# EAGLE design STM32G030F6P6TR-dev-board-plus-imu (EAGLE 9.4.2)
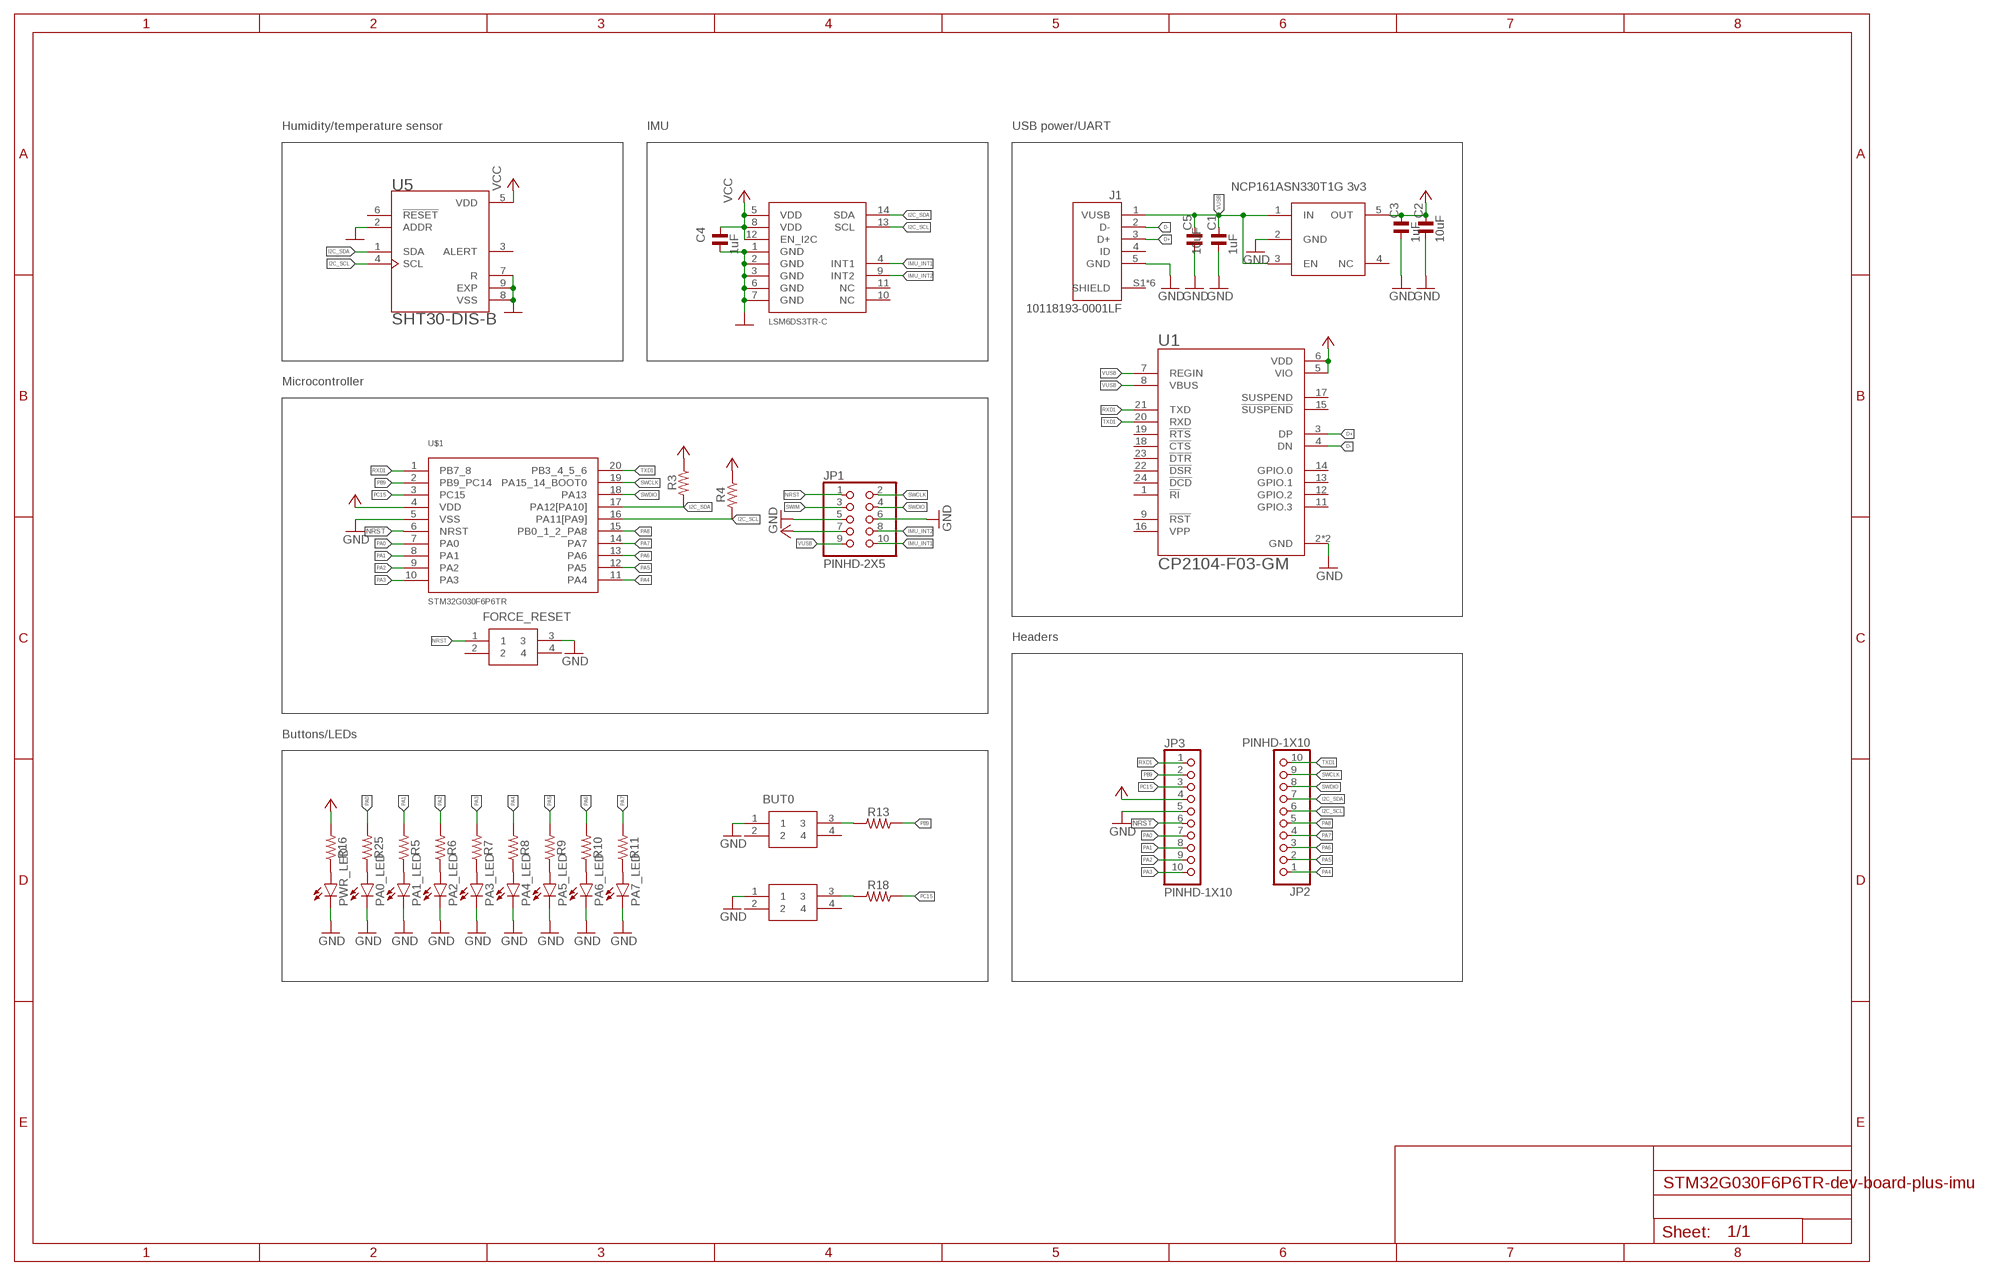
[diagram p0: schematic, sheet 1]

## Parts
3V3_REG1  3V3  NCP718BSN330T1G  [NCP718BSN330T1G]
BUT0  PTS645SM43SMTR92LFS  [PTS645(SMT)]
BUT1  PTS645SM43SMTR92LFS  [PTS645(SMT)]
C1  1uF  RC-MASTER-SMD_C_0603MP  [RC-MASTER-SMD_C0603MP]
C2  10uF  RC-MASTER-SMD_C_0603MP  [RC-MASTER-SMD_C0603MP]
C3  1uF  RC-MASTER-SMD_C_0603MP  [RC-MASTER-SMD_C0603MP]
C4  1uF  RC-MASTER-SMD_C_0603MP  [RC-MASTER-SMD_C0603MP]
C5  10uF  RC-MASTER-SMD_C_0603MP  [RC-MASTER-SMD_C0603MP]
FORCE_RESET  PTS645SM43SMTR92LFS  [PTS645(SMT)]
J1  10118193-0001LF  [FCI_10118193-0001LF]
JP1  PINHD-2X5  [2X05]
JP2  PINHD-1X10  [1X10]
JP3  PINHD-1X10  [1X10]
PA0_LED  20mA  LEDCHIP-LED0603  [CHIP-LED0603]
PA1_LED  20mA  LEDCHIP-LED0603  [CHIP-LED0603]
PA2_LED  20mA  LEDCHIP-LED0603  [CHIP-LED0603]
PA3_LED  20mA  LEDCHIP-LED0603  [CHIP-LED0603]
PA4_LED  20mA  LEDCHIP-LED0603  [CHIP-LED0603]
PA5_LED  20mA  LEDCHIP-LED0603  [CHIP-LED0603]
PA6_LED  20mA  LEDCHIP-LED0603  [CHIP-LED0603]
PA7_LED  20mA  LEDCHIP-LED0603  [CHIP-LED0603]
PWR_LED  20mA  LEDCHIP-LED0603  [CHIP-LED0603]
R3  3k3  52101-101-REV-A_RC-MASTER-SMD_R_0603MP  [52101-101-REV-A_RC-MASTER-SMD_R0603MP]
R4  3k3  52101-101-REV-A_RC-MASTER-SMD_R_0603MP  [52101-101-REV-A_RC-MASTER-SMD_R0603MP]
R5  1K  52101-101-REV-A_RC-MASTER-SMD_R_0603MP  [52101-101-REV-A_RC-MASTER-SMD_R0603MP]
R6  1K  52101-101-REV-A_RC-MASTER-SMD_R_0603MP  [52101-101-REV-A_RC-MASTER-SMD_R0603MP]
R7  1K  52101-101-REV-A_RC-MASTER-SMD_R_0603MP  [52101-101-REV-A_RC-MASTER-SMD_R0603MP]
R8  1K  52101-101-REV-A_RC-MASTER-SMD_R_0603MP  [52101-101-REV-A_RC-MASTER-SMD_R0603MP]
R9  1K  52101-101-REV-A_RC-MASTER-SMD_R_0603MP  [52101-101-REV-A_RC-MASTER-SMD_R0603MP]
R10  1K  52101-101-REV-A_RC-MASTER-SMD_R_0603MP  [52101-101-REV-A_RC-MASTER-SMD_R0603MP]
R11  1K  52101-101-REV-A_RC-MASTER-SMD_R_0603MP  [52101-101-REV-A_RC-MASTER-SMD_R0603MP]
R13  100R  52101-101-REV-A_RC-MASTER-SMD_R_0603MP  [52101-101-REV-A_RC-MASTER-SMD_R0603MP]
R16  1K  52101-101-REV-A_RC-MASTER-SMD_R_0603MP  [52101-101-REV-A_RC-MASTER-SMD_R0603MP]
R18  100R  52101-101-REV-A_RC-MASTER-SMD_R_0603MP  [52101-101-REV-A_RC-MASTER-SMD_R0603MP]
R25  1K  52101-101-REV-A_RC-MASTER-SMD_R_0603MP  [52101-101-REV-A_RC-MASTER-SMD_R0603MP]
U1  CP2104-F03-GM  [QFN50P400X400X80-25N]
U5  SHT30-DIS-B  [DFN250X250X100-9N]
U$1  STM32G030F6P6TR  [SOP65P640X120-20N]
U$2  LSM6DS3TR-IMU  [LSM6DS3TR]

## Nets
D+: J1.3(D+) U1.3(DP)
D-: J1.2(D-) U1.4(DN)
GND: 3V3_REG1.2(GND) BUT0.1 BUT1.1 C1.1 C2.1 C3.1 C4.1 C5.1 FORCE_RESET.3 J1.5(GND) JP1.5 JP1.6 JP3.5 PA0_LED.C PA1_LED.C PA2_LED.C PA3_LED.C PA4_LED.C PA5_LED.C PA6_LED.C PA7_LED.C PWR_LED.C U1.2(GND) U1.25(GND) U5.2(ADDR) U5.7(R) U5.8(VSS) U5.9(EXP) U$1.5(VSS) U$2.1(GND) U$2.2(GND) U$2.3(GND) U$2.6(GND) U$2.7(GND)
I2C_SCL: JP2.6 R4.2 U5.4(SCL) U$1.16(PA11[PA9]) U$2.13(SCL)
I2C_SDA: JP2.7 R3.2 U5.1(SDA) U$1.17(PA12[PA10]) U$2.14(SDA)
IMU_INT1: JP1.10 U$2.4(INT1)
IMU_INT2: JP1.8 U$2.9(INT2)
N$3: PA1_LED.A R5.1
N$4: PA2_LED.A R6.1
N$5: PA0_LED.A R25.1
N$6: PA3_LED.A R7.1
N$7: PA4_LED.A R8.1
N$8: PA5_LED.A R9.1
N$9: PA6_LED.A R10.1
N$10: PA7_LED.A R11.1
N$12: BUT0.3 R13.2
N$15: PWR_LED.A R16.1
N$17: BUT1.3 R18.2
NRST: FORCE_RESET.1 JP1.1 JP3.6 U$1.6(NRST)
PA0: JP3.7 R25.2 U$1.7(PA0)
PA1: JP3.8 R5.2 U$1.8(PA1)
PA2: JP3.9 R6.2 U$1.9(PA2)
PA3: JP3.10 R7.2 U$1.10(PA3)
PA4: JP2.1 R8.2 U$1.11(PA4)
PA5: JP2.2 R9.2 U$1.12(PA5)
PA6: JP2.3 R10.2 U$1.13(PA6)
PA7: JP2.4 R11.2 U$1.14(PA7)
PA8: JP2.5 U$1.15(PB0_1_2_PA8)
PB9: JP3.2 R13.1 U$1.2(PB9_PC14)
PC15: JP3.3 R18.1 U$1.3(PC15)
RXD1: JP3.1 U1.21(TXD) U$1.1(PB7_8)
SWCLK: JP1.2 JP2.9 U$1.19(PA15_14_BOOT0)
SWDIO: JP1.4 JP2.8 U$1.18(PA13)
SWIM: JP1.3
TXD1: JP2.10 U1.20(RXD) U$1.20(PB3_4_5_6)
VCC: 3V3_REG1.5(OUT) C2.2 C3.2 C4.2 JP1.7 JP3.4 R3.1 R4.1 R16.2 U1.5(VIO) U1.6(VDD) U5.5(VDD) U$1.4(VDD) U$2.5(VDD) U$2.8(VDD) U$2.12(EN_I2C)
VUSB: 3V3_REG1.1(IN) 3V3_REG1.3(EN) C1.2 C5.2 J1.1(VUSB) JP1.9 U1.7(REGIN) U1.8(VBUS)
Unconnected: 3V3_REG1.4(NC) BUT0.2 BUT0.4 BUT1.2 BUT1.4 FORCE_RESET.2 FORCE_RESET.4 J1.4(ID) J1.S1(SHIELD) J1.S2(SHIELD) J1.S3(SHIELD) J1.S4(SHIELD) J1.S5(SHIELD) J1.S6(SHIELD) U1.1(!RI) U1.9(!RST!) U1.11(GPIO.3) U1.12(GPIO.2) U1.13(GPIO.1) U1.14(GPIO.0) U1.15(!SUSPEND!) U1.16(VPP) U1.17(SUSPEND) U1.18(!CTS) U1.19(!RTS) U1.22(!DSR) U1.23(!DTR) U1.24(!DCD) U5.3(ALERT) U5.6(!RESET) U$2.10(NC) U$2.11(NC)

## Notes on the sheet
- Humidity/temperature sensor | IMU | USB power/UART
- NCP161ASN330T1G 3v3
- Microcontroller
- Headers
- Buttons/LEDs

## Library data of the parts
3V3_REG1 = IC-packages_BIG-pack V1.0:NCP718BSN330T1G
BUT0 BUT1 FORCE_RESET = PTS645SM43SMTR92LFS:PTS645SM43SMTR92LFS: C & K COMPONENTS - PTS645SM43SMTR92LFS - SWITCH, SPST, 0.05A, 12VDC, SMD, 4.3MM Source: Datasheet <http://www.farnell.com/datasheets/1914518.pdf>; DESCRIPTION: C & K COMPONENTS - PTS645SM43SMTR92LFS - SWITCH, SPST, 0.05A, 12VDC, SMD, 4.3MM; HEIGHT: mm; MANUFACTURER_NAME: C & K COMPONENTS; MANUFACTURER_PART_NUMBER: PTS645SM43SMTR92LFS; MOUSER_PART_NUMBER: 611-PTS645SM43SMTR92; MOUSER_PRICE-STOCK: https://www.mouser.com/Search/Refine.aspx?Keyword=611-PTS645SM43SMTR92
C1-C5 = 52101-101-REV-A:RC-MASTER-SMD_C_: NON-POLARIZED CAP
J1 = 10118193-0001LF:10118193-0001LF: Micro USB B Type Receptacle Check prices <https://pricing.snapeda.com/parts/10118193-0001LF/AMPHENOL%20ICC%20/%20FCI/view-part?ref=eda>; AVAILABILITY: In Stock; DESCRIPTION: Micro USB 2.0, Input Output Connectors, B TYPE RECEPTACLE; MF: AMPHENOL ICC / FCI; MP: 10118193-0001LF; PACKAGE: None; PRICE: None; PURCHASE-URL: https://pricing.snapeda.com/search/part/10118193-0001LF/?ref=eda
JP1 = Connector:PINHD-2X5: PIN HEADER; CATEGORY: CONNECTOR; SUB-CATEGORY: PIN-HEADER
JP2 JP3 = Connector:PINHD-1X10: PIN HEADER; CATEGORY: CONNECTOR; SUB-CATEGORY: PIN-HEADER
PA0_LED PA1_LED PA2_LED PA3_LED PA4_LED PA5_LED PA6_LED PA7_LED PWR_LED = led:LED: LED OSRAM: - CHIPLED LG R971, LG N971, LY N971, LG Q971, LY Q971, LO R971, LY R971 LH N974, LH R974 LS Q976, LO Q976, LY Q976 LO Q996 - Hyper CHIPLED LW Q18S LB Q993, LB Q99A, LB R99A - SideLED LS A670, LO A670, LY A670, LG A670, LP A670 LB A673, LV A673, LT A673, LW A673 LH A674 LY A675 LS A676, LA A676, LO A676, LY A676, LW A676 LS A679, LY A679, LG A679 - Hyper Micro SIDELED® LS Y876, LA Y876, LO Y876, LY Y876 LT Y87S - SmartLED LW L88C, LW L88S LB L89C, LB L89S, LG L890 LS L89K, LO L89K, LY L89K LS L896, LA L896, LO L896, LY L896 - TOPLED LS T670, LO T670, LY T670, LG T670, LP T670 LSG T670, LSP T670, LSY T670, LOP T670, LYG T670 LG T671, LOG T671, LSG T671 LB T673, LV T673, LT T673, LW T673 LH T674 LS T676, LA T676, LO T676, LY T676, LB T676, LH T676, LSB T676, LW T676 LB T67C, LV T67C, LT T67C, LS T67K, LO T67K, LY T67K, LW E67C LS E67B, LA E67B, LO E67B, LY E67B, LB E67C, LV E67C, LT E67C LW T67C LS T679, LY T679, LG T679 LS T770, LO T770, LY T770, LG T770, LP T770 LB T773, LV T773, LT T773, LW T773 LH T774 LS E675, LA E675, LY E675, LS T675 LS T776, LA T776, LO T776, LY T776, LB T776 LHGB T686 LT T68C, LB T68C - Hyper Mini TOPLED® LB M676 - Mini TOPLED Santana® LG M470 LS M47K, LO M47K, LY M47K Source: http://www.osram.convergy.de LUXEON: - LUMILED® LXK2-PW12-R00, LXK2-PW12-S00, LXK2-PW14-U00, LXK2-PW14-V00 LXK2-PM12-R00, LXK2-PM12-S00, LXK2-PM14-U00 LXK2-PE12-Q00, LXK2-PE12-R00, LXK2-PE12-S00, LXK2-PE14-T00, LXK2-PE14-U00 LXK2-PB12-K00, LXK2-PB12-L00, LXK2-PB12-M00, LXK2-PB14-N00, LXK2-PB14-P00, LXK2-PB14-Q00 LXK2-PR12-L00, LXK2-PR12-M00, LXK2-PR14-Q00, LXK2-PR14-R00 LXK2-PD12-Q00, LXK2-PD12-R00, LXK2-PD12-S00 LXK2-PH12-R00, LXK2-PH12-S00 LXK2-PL12-P00, LXK2-PL12-Q00, LXK2-PL12-R00 Source: www.luxeon.com KINGBRIGHT: KA-3528ASYC Source: www.kingbright.com
R3-R11 R13 R16 R18 R25 = ESP32_DMX_Audio:52101-101-REV-A_RC-MASTER-SMD_R_: RESISTOR
U1 = CP2104:CP2104: Silabs CP2104 USB to UART Bridge; AVAILABILITY: Unavailable; DESCRIPTION: USB to UART Bridge; MF: Silicon Labs; MP: CP2104; PACKAGE: QFN-24 Silicon Labs; PRICE: None
U5 = SHT30-DIS-B:SHT30-DIS-B: SHT3x Series 5.5 V ±3 %RH 0 to 100% Temperature and Humidity Sensor - DFN-8 Check availability <https://pricing.snapeda.com/parts/SHT30-DIS-B/Sensirion%20AG/view-part?ref=eda>; AVAILABILITY: In Stock; DESCRIPTION: Humidity Temperature Sensor 0 ~ 100% RH I²C ±2% RH 8 s Surface Mount; MF: Sensirion AG; MP: SHT30-DIS-B; PACKAGE: DFN-8 Sensirion; PRICE: None; PURCHASE-URL: https://pricing.snapeda.com/search/part/SHT30-DIS-B/?ref=eda
U$1 = SOP65P640X120-20N:STM32G030F6P6TR
U$2 = LSM6DS3TR-IMU:LSM6DS3TR-IMU

## Board
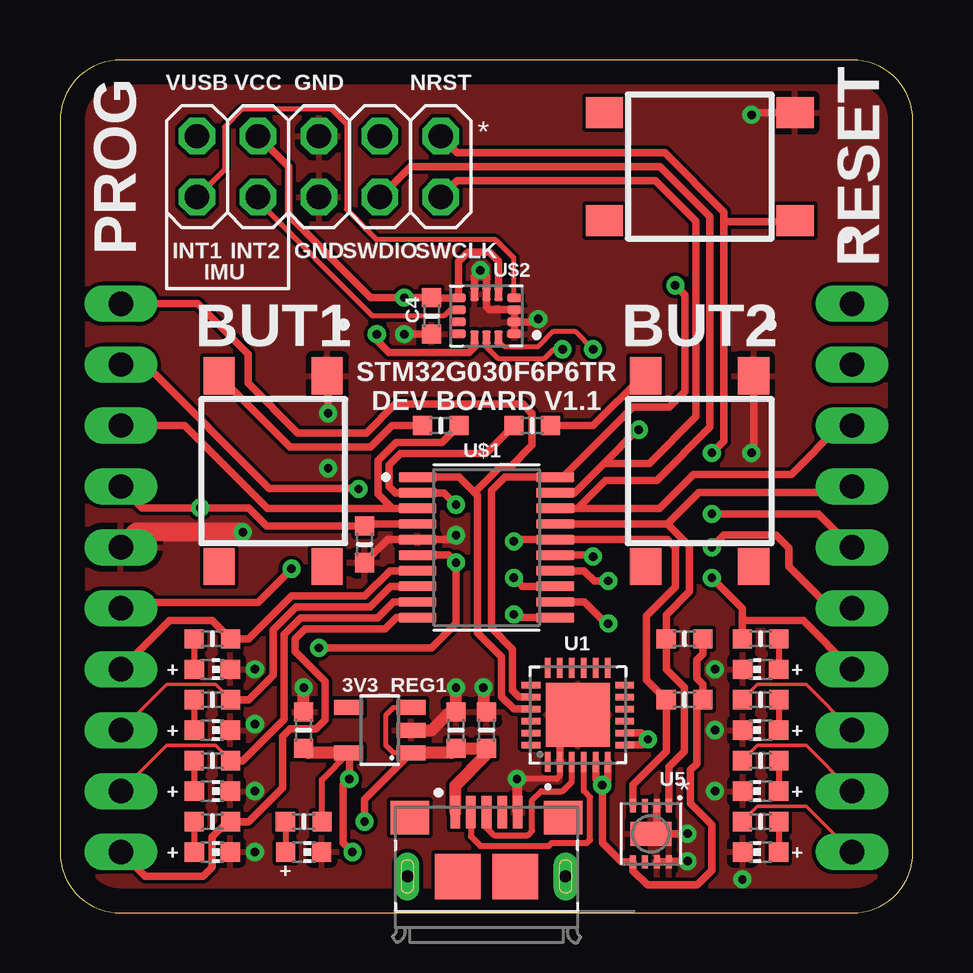
[diagram p1: board, top side]
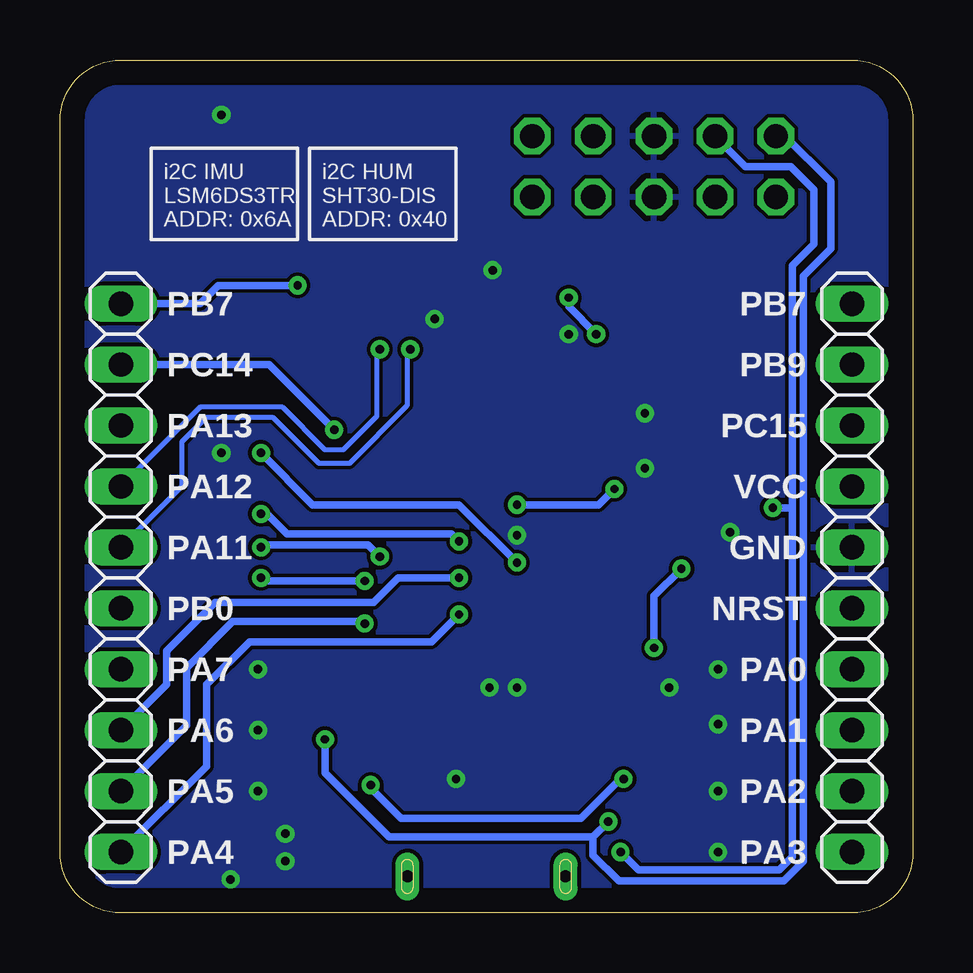
[diagram p2: board, bottom side, seen from below]

Size 35.56 x 35.56 mm. Coordinates in mm from the lower left corner, seen from the top.
Outline: 0,33.02 0,2.54 arc90 2.54,0 33.02,0 arc90 35.56,2.54 35.56,33.02 arc90 33.02,35.56 2.54,35.56 arc90 0,33.02
Copper layers (1*16): Top 0.035mm / dielectric 1.5mm / Bottom 0.035mm
Design rules "default": minimum track width 6mil, minimum drill 0.35mm, track to track 6mil, track to pad 6mil, pad to pad 6mil, via to via 6mil, smd to smd 6mil, copper to edge 40mil, drill to drill 6mil, minimum pad ring 10mil, minimum via ring 8mil, stop-mask expansion 4mil, vias tented up to drill 0mil, thermal gap 10mil

### Footprints (pad centres in the part's own frame; a part is rotated, then mirrored left to right if it is on the bottom)
NCP718BSN330T1G = smd 0.62 x 1.22: 1 -0.95,-1.3; 2 0,-1.3; 3 0.95,-1.3; 4 0.95,1.3; 5 -0.95,1.3
PTS645(SMT) = smd 1.55 x 1.3: 1 -3.975,2.25; 2 3.975,2.25; 3 -3.975,-2.25; 4 3.975,-2.25
RC-MASTER-SMD_C0603MP = smd 0.8 x 0.8: 1 -0.762,0; 2 0.762,0
FCI_10118193-0001LF = smd 0.4 x 1.35: 1 -1.3,2.675; 2 -0.65,2.675; 3 0,2.675; 4 0.65,2.675; 5 1.3,2.675 | smd 1.6 x 1.4: S1 -3.2,2.45; S2 3.2,2.45 | smd 1.9 x 1.9: S3 1.2,0; S4 -1.2,0 | drill 0.5 pad 0.9 long: S5 -3.3,0; S6 3.3,0
2X05 = drill 1.016 octagon: 1 -5.08,-1.27; 2 -5.08,1.27; 3 -2.54,-1.27; 4 -2.54,1.27; 5 0,-1.27; 6 0,1.27; 7 2.54,-1.27; 8 2.54,1.27; 9 5.08,-1.27; 10 5.08,1.27
1X10 = drill 1.016 long: 1 -11.43,0; 2 -8.89,0; 3 -6.35,0; 4 -3.81,0; 5 -1.27,0; 6 1.27,0; 7 3.81,0; 8 6.35,0; 9 8.89,0; 10 11.43,0
CHIP-LED0603 = smd 0.8 x 0.8: A 0,-0.75; C 0,0.75
52101-101-REV-A_RC-MASTER-SMD_R0603MP = smd 0.8 x 0.8: 1 -0.762,0; 2 0.762,0
QFN50P400X400X80-25N = smd 0.81 x 0.26: 1 -1.955,1.25; 2 -1.955,0.75; 3 -1.955,0.25; 4 -1.955,-0.25; 5 -1.955,-0.75; 6 -1.955,-1.25; 13 1.955,-1.25; 14 1.955,-0.75; 15 1.955,-0.25; 16 1.955,0.25; 17 1.955,0.75; 18 1.955,1.25 | smd 0.26 x 0.81: 7 -1.25,-1.955; 8 -0.75,-1.955; 9 -0.25,-1.955; 10 0.25,-1.955; 11 0.75,-1.955; 12 1.25,-1.955; 19 1.25,1.955; 20 0.75,1.955; 21 0.25,1.955; 22 -0.25,1.955; 23 -0.75,1.955; 24 -1.25,1.955 | smd 2.68 x 2.68: 25 0,0
DFN250X250X100-9N = smd 0.55 x 0.25: 1 -1.175,0.75; 2 -1.175,0.25; 3 -1.175,-0.25; 4 -1.175,-0.75; 5 1.175,-0.75; 6 1.175,-0.25; 7 1.175,0.25; 8 1.175,0.75 | smd 1 x 1.7: 9 0,0
SOP65P640X120-20N = smd 1.57 x 0.41: 1 -2.87,2.925; 2 -2.87,2.275; 3 -2.87,1.625; 4 -2.87,0.975; 5 -2.87,0.325; 6 -2.87,-0.325; 7 -2.87,-0.975; 8 -2.87,-1.625; 9 -2.87,-2.275; 10 -2.87,-2.925; 11 2.87,-2.925; 12 2.87,-2.275; 13 2.87,-1.625; 14 2.87,-0.975; 15 2.87,-0.325; 16 2.87,0.325; 17 2.87,0.975; 18 2.87,1.625; 19 2.87,2.275; 20 2.87,2.925
LSM6DS3TR = smd 0.61 x 0.35: 1 -1.16,0.75; 2 -1.16,0.25; 3 -1.16,-0.25; 4 -1.16,-0.75; 8 1.16,-0.75; 9 1.16,-0.25; 10 1.16,0.25; 11 1.16,0.75 | smd 0.35 x 0.61: 5 -0.5,-0.91; 6 0,-0.91; 7 0.5,-0.91; 12 0.5,0.91; 13 0,0.91; 14 -0.5,0.91

### Placement (x,y rotation side)
3V3_REG1  13.34,7.62 90 top
BUT0  26.67,18.41 270 top
BUT1  8.89,18.41 270 top
C1  17.78,7.62 270 top
C2  10.16,7.62 270 top
C3  12.7,15.37 90 top
C4  15.49,24.89 90 top
C5  16.51,7.62 270 top
FORCE_RESET  26.67,31.11 180 top
J1  17.78,1.52 0 top
JP1  10.79,31.11 180 top
JP2  33.02,13.97 90 bottom
JP3  2.54,13.97 270 bottom
PA0_LED  6.35,10.16 270 top
PA1_LED  6.35,7.62 270 top
PA2_LED  6.35,5.08 270 top
PA3_LED  6.35,2.54 270 top
PA4_LED  29.21,2.54 90 top
PA5_LED  29.21,5.08 90 top
PA6_LED  29.21,7.62 90 top
PA7_LED  29.21,10.16 90 top
PWR_LED  10.16,2.54 270 top
R3  26.04,11.43 180 top
R4  26.04,8.89 180 top
R5  6.35,8.89 0 top
R6  6.35,6.35 0 top
R7  6.35,3.81 0 top
R8  29.21,3.81 180 top
R9  29.21,6.35 180 top
R10  29.21,8.89 180 top
R11  29.21,11.43 180 top
R13  19.68,20.32 0 top
R16  10.16,3.81 0 top
R18  15.88,20.32 180 top
R25  6.35,11.43 0 top
U1  21.59,8.26 90 top
U5  24.64,3.3 270 top
U$1  17.78,15.24 0 top
U$2  17.78,24.89 180 top

### Tracks (layer width: path | path; a pad name or v marks a point on that pad's centre or on a via)
D+
  Top 0.254: J1.3 17.78,3.56 18.09,3.25 19.5,3.25 19.68,3.43 19.68,4.7 20.07,5.08 20.95,5.08 21.34,5.46 U1.3
D-
  Top 0.254: J1.2 17.13,3.19 17.53,2.79 20.38,2.79 20.5,2.92 21.97,2.92 22.1,3.05 22.1,4.83 21.84,5.08 U1.4
GND  (via drill 0.35)
  Top 0.152: U$2.3
  Top 0.254: U1.2 20.84,5.73 20.7,5.59 v19.05,5.59
  Top 0.305: 19.08,5.56 v19.05,5.59 | BUT1.1 11.18,22.35 v11.18,20.83 | BUT0.1 28.92,19.27 v28.83,19.18 | U1.2 20.84,7.5 U1.25 | U5.7 U5.8 25.42,2.16 v26.16,2.16 | U5.9 24.89,3.3 | 24.89,3.3 v26.16,3.3 | U5.2 24.89,3.3 | v16.51,15.75 16.33,15.56 U$1.5 13.66,15.56 C3.1 | FORCE_RESET.3 28.92,33.37 v28.83,33.27 | U$2.7 17.28,26.55 v17.53,26.8 17.78,26.54 U$2.6 17.78,25.27 17.91,25.15 U$2.3 | U$2.2 U$2.3 | U$2.1 U$2.2 | U$2.2 19.82,24.64 v19.94,24.77 | C4.1 v14.35,24.13
  Top 0.406: J1.5 19.08,5.56
  Top 0.508: 3V3_REG1.2 15.49,7.62 16.26,8.38 C5.1 v16.51,9.4 | v17.65,9.4 17.65,8.51 C1.1 | C2.1 v10.16,9.4
  Top 0.762: v7.62,15.88 3.17,15.88 JP3.5
  other vias: 8.13,10.16 8.13,7.87 8.13,5.08 8.13,2.54 11.18,18.54 27.3,10.16 27.3,7.62 27.3,5.08 28.45,1.4
  pour Top: -2.54,38.1 38.1,38.1 38.1,-2.54 -2.54,-2.54
  pour Bottom: -2.54,38.1 38.1,38.1 38.1,-2.54 -2.54,-2.54
I2C_SCL  (via drill 0.35)
  Top 0.152: U$2.13 17.75,23.95
  Top 0.203: 17.75,23.95 17.75,23.63 18.27,23.11 20.19,23.11 20.57,23.5 v20.95,23.5
  Top 0.305: U5.4 23.89,5.35 25.27,6.73 R4.2 24.44,9.72 24.44,12.38 25.65,13.59 25.65,15.24 25.33,15.56 U$1.16 18.99,15.56 v18.92,15.49 | v27.18,16.64 31.62,16.64 JP2.6
  Bottom 0.203: v20.95,23.5 21.08,23.37 21.08,21.16 23.5,18.75 24.76,18.75 26.67,20.65 29.46,20.65 30.48,19.64 30.48,17.78 JP2.6
  Bottom 0.305: v18.92,15.49 19.23,15.8 26.09,15.8 26.92,16.64 v27.18,16.64
I2C_SDA  (via drill 0.35)
  Top 0.203: U$2.14 18.28,23.86 18.51,23.62 19.94,23.62 20.57,24.26 21.46,24.26 v22.23,23.5
  Top 0.305: 25.33,16.21 26.24,15.3 26.24,13.4 25.27,12.43 R3.2 25.27,10.16 26.04,9.4 26.04,6.73 25.39,6.08 U5.1 | 25.33,16.21 U$1.17 | 25.33,16.21 26.64,17.53 32.77,17.53 JP2.7
  Bottom 0.203: v22.23,23.5 22.35,23.37 22.35,20.7 23.75,19.3 24.51,19.3 26.29,21.08 29.72,21.08 JP2.7
IMU_INT1
  Top 0.152: U$2.4 18.92,25.66
  Top 0.203: 18.92,25.66 18.92,27.3 18.16,28.07 13.21,28.07 11.94,29.34 11.94,32.89 11.3,33.53 7.62,33.53 6.86,32.77 6.86,30.99 JP1.10
IMU_INT2
  Top 0.203: U$2.9 16.25,25.14 16,24.89 13.03,24.89 8.26,29.67 JP1.8
N$3
  Top 0.254: R5.1 5.59,7.63 PA1_LED.A
N$4
  Top 0.254: R6.1 5.59,5.09 PA2_LED.A
N$5
  Top 0.254: R25.1 5.59,10.17 PA0_LED.A
N$6
  Top 0.254: R7.1 5.6,3.8 PA3_LED.A
N$7
  Top 0.254: R8.1 29.97,2.55 PA4_LED.A
N$8
  Top 0.254: R9.1 29.97,5.09 PA5_LED.A
N$9
  Top 0.254: R10.1 29.97,7.63 PA6_LED.A
N$10
  Top 0.254: R11.1 29.97,10.17 PA7_LED.A
N$12
  Top 0.305: R13.2 22.22,20.32 24.29,22.39 BUT0.3
N$15
  Top 0.254: R16.1 9.4,2.55 PWR_LED.A
N$17
  Top 0.305: R18.2 13.84,20.32 12.95,19.43 9.6,19.43 BUT1.3
NRST  (via drill 0.35)
  Top 0.305: U$1.6 16.2,14.91 v16.51,14.61 16.51,12.06 15.49,11.05 v10.79,11.05 | v27.18,19.18 27.69,19.68 27.69,28.83 | 27.69,28.83 27.69,29.22 25.21,31.7 16.56,31.7 JP1.1 | FORCE_RESET.1 30.61,28.83 27.69,28.83 | v9.65,14.35 8.26,12.95 2.79,12.95 JP3.6
  Bottom 0.305: v16.51,14.61 18.92,17.02 25.02,17.02 v27.18,19.18 | v9.65,14.35 10.79,13.21 v10.79,11.05
PA0
  Top 0.305: U$1.7 13.76,14.27 12.7,13.21 9.65,13.21 7.87,11.43 R25.2 6.35,12.19 5.08,12.19 4.57,12.19 JP3.7
PA1
  Top 0.152: R5.2 6.48,9.52 4.44,9.52 JP3.8
  Top 0.305: U$1.8 14.9,13.6 13.78,13.6 12.92,12.75 9.84,12.75 8.89,11.8 8.89,9.91 7.87,8.89 R5.2
PA2
  Top 0.152: R6.2 6.48,6.98 4.44,6.98 JP3.9
  Top 0.305: R6.2 7.62,6.35 9.35,8.08 9.35,11.61 10.03,12.29 13.24,12.29 13.91,12.96 U$1.9
PA3
  Top 0.305: U$1.10 14.02,12.31 13.54,11.84 10.22,11.84 9.8,11.42 9.8,10.9 11.05,9.65 11.05,8.04 10.69,7.68 9.59,7.68 9.27,7.35 9.27,5.21 7.87,3.81 R7.2 6.99,3.81 6.35,3.17 6.35,1.91 5.97,1.52 3.81,1.52 3.56,1.52 JP3.10
PA4  (via drill 0.35)
  Top 0.152: R8.2 29.08,4.44 31.12,4.44 JP2.1
  Top 0.305: v18.92,12.45 19.05,12.31 U$1.11
  Bottom 0.305: v18.92,12.45 20.07,11.3 27.66,11.3 29.44,9.53 29.44,6.12 JP2.1
PA5  (via drill 0.35)
  Top 0.152: R9.2 29.08,6.98 31.12,6.98 JP2.2
  Top 0.305: v22.86,12.06 22.76,12.06 21.86,12.96 U$1.12
  Bottom 0.305: v22.86,12.06 22.94,12.14 28.36,12.14 30.28,10.22 30.28,7.82 JP2.2
PA6  (via drill 0.35)
  Top 0.152: R10.2 29.08,9.52 31.12,9.52 JP2.3
  Top 0.305: v18.92,13.97 19.28,13.62 U$1.13
  Bottom 0.305: v18.92,13.97 21.46,13.97 22.48,12.95 29.08,12.95 31.11,10.92 31.11,9.53 JP2.3
PA7  (via drill 0.35)
  Top 0.305: R11.2 28.45,12.19 | 28.45,12.19 28.45,12.7 v27.18,13.97 | v22.86,13.84 22.27,13.84 21.85,14.27 U$1.14 | 28.45,12.19 30.99,12.19 JP2.4
  Bottom 0.305: v27.18,13.97 27.05,13.84 v22.86,13.84
PA8  (via drill 0.35)
  Top 0.305: U$1.15 22.17,14.91 v22.23,14.86 | v27.18,15.24 27.69,15.75 29.85,15.75 30.38,15.21 30.38,14.45 32.13,12.7 JP2.5
  Bottom 0.305: v22.23,14.86 22.71,15.34 27.08,15.34 v27.18,15.24
PB9  (via drill 0.35)
  Top 0.305: R13.1 17.76,19.16 14.21,19.16 13.72,18.67 13.72,17.78 13.98,17.52 U$1.2 16.01,17.52 v16.51,17.02 | v12.45,17.68 12.42,17.7 8.72,17.7 3.69,22.74 3.57,22.86 JP3.2
  Bottom 0.305: v16.51,17.02 13.1,17.02 v12.45,17.68
PC15
  Top 0.305: R18.1 15.93,19.61 14.02,19.61 13.26,18.86 13.26,17.48 13.87,16.86 | 13.87,16.86 U$1.3 | 13.87,16.86 8.66,16.86 5.21,20.32 JP3.3
RXD1
  Top 0.305: U1.21 18.92,8.51 18.41,9.01 18.41,10.67 17.4,11.68 17.4,17.4 17.27,17.53 | 17.27,17.53 16.63,18.16 U$1.1 | 17.27,17.53 17.27,17.54 18.36,18.62 18.8,18.62 19.68,19.51 19.68,20.83 19.3,21.21 13.97,21.21 12.78,20.02 9.91,20.02 7.85,22.08 7.85,23.29 5.74,25.4 JP3.1
SWCLK  (via drill 0.35)
  Top 0.305: U$1.19 21.45,17.52 22.68,18.75 | JP1.2 16.56,30.53 24.83,30.53 26.52,28.84 26.52,20.7 24.56,18.75 22.68,18.75 | 22.68,18.75 24.08,20.14 v24.13,20.14
  Bottom 0.305: JP2.9 26.84,22.86 v24.13,20.14
SWDIO
  Top 0.305: JP1.4 14.61,31.11 25.02,31.11 27.1,29.03 27.1,20.25 24.88,18.03 22.73,18.03 21.56,16.86 U$1.18 24.99,16.86 26.42,18.29 30.48,18.29 32.51,20.32 JP2.8
TXD1  (via drill 0.35)
  Top 0.305: U1.20 19.14,9.01 18.87,9.27 18.87,10.98 17.98,11.87 17.98,17.6 18.55,18.16 U$1.20 20.96,18.16 23.88,21.08 25.4,21.08 26.06,21.74 26.06,25.76 v25.65,26.16
  Bottom 0.305: JP2.10 29.72,25.4 28.96,26.16 v25.65,26.16
VCC  (via drill 0.35)
  Top 0.152: U$2.5 | 15.51,25.64 C4.2
  Top 0.254: R16.2 10.92,5.56 12.02,6.65 3V3_REG1.5
  Top 0.305: U$1.4 12.79,16.21 C3.2 8.62,16.13 7.86,16.89 v5.84,16.89 3.43,16.89 JP3.4 | v22.61,5.33 22.84,5.57 U1.6 | 12.02,6.65 12.06,6.6 v12.06,5.59 11.81,5.33 11.81,2.92 v12.19,2.54 | v22.61,5.33 22.61,2.92 23.4,2.13 U5.5 23.89,1.77 24.49,1.17 26.57,1.17 27.18,1.78 27.18,3.68 26.29,4.57 26.29,5.97 26.54,6.22 26.54,8.64 R4.1 26.8,9.53 26.54,9.78 26.54,10.54 26.8,10.79 R3.1 | U1.5 22.34,5.6 v22.61,5.33 | U$2.5 18.29,27.18 17.91,27.56 17.02,27.56 16.62,27.16 U$2.8 15.51,25.64 | JP1.7 9.53,31.11 9.53,29.08 12.95,25.65 v14.35,25.65 C4.2 | U$2.12 17.28,23.6 17.05,23.37 13.72,23.37 13.21,23.88 v13.21,24.13
  Top 0.508: 3V3_REG1.5 10.35,6.67 C2.2
  Bottom 0.305: v22.61,5.33 22.61,5.21 21.34,3.94 13.84,3.94 12.19,5.59 v12.06,5.59 | 5.03,16.89 5.03,2.34 5.56,1.8 11.46,1.8 v12.19,2.54 | 5.03,16.89 v5.84,16.89 | JP1.7 6.99,31.11 5.09,31.11 4.14,30.16 4.14,27.88 5.03,26.99 5.03,16.89 | v14.35,25.65 14.35,25.27 v13.21,24.13
VUSB  (via drill 0.35)
  Top 0.203: 3V3_REG1.1 13.9,6.67 13.59,6.99 13.59,8.26 13.9,8.57 3V3_REG1.3
  Top 0.305: U1.8 24.25,7.5 v24.51,7.24 24.28,7 U1.7 | v12.7,3.81 12.7,4.74 3V3_REG1.1
  Top 0.508: 3V3_REG1.1 16.32,6.67 C5.2 C1.2 17.78,6.6 16.48,5.3 J1.1
  Bottom 0.305: v24.51,7.24 24.51,5.84 21.84,3.17 13.34,3.17 | 13.34,3.17 v12.7,3.81 | 13.34,3.17 13.34,2.41 12.27,1.35 5.37,1.35 4.57,2.15 4.57,26.54 3.43,27.69 3.43,30.48 5.33,32.38 JP1.9

### Text on the board
tPlace: VUSB | VCC | GND | NRST | * | PROG | RESET | INT1 | INT2 | GND | SWDIO | SWCLK | IMU | BUT1 | BUT2 | STM32G030F6P6TR / DEV BOARD V1.1 | + | + | + | + | + | * | + | + | + | +
bPlace: i2C HUM / SHT30-DIS / ADDR: 0x40 | i2C IMU / LSM6DS3TR / ADDR: 0x6A | PB7 | PB7 | PB9 | PC14 | PC15 | PA13 | VCC | PA12 | GND | PA11 | NRST | PB0 | PA0 | PA7 | PA1 | PA6 | PA2 | PA5 | PA3 | PA4